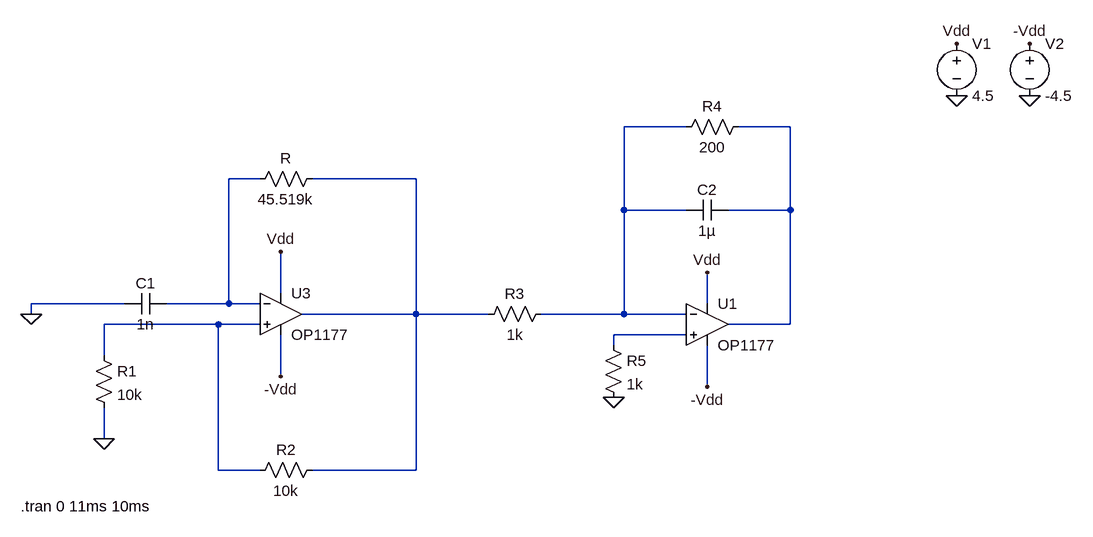
[diagram p0: schematic 2a.asc]
2a.asc, the LTspice schematic file:
Version 4.1
SHEET 1 1464 680
WIRE 864 -144 768 -144
WIRE 1024 -144 944 -144
WIRE 208 -64 160 -64
WIRE 448 -64 288 -64
WIRE 768 -16 768 -144
WIRE 864 -16 768 -16
WIRE 1024 -16 1024 -144
WIRE 1024 -16 928 -16
WIRE 240 112 240 48
WIRE 0 128 -144 128
WIRE 160 128 160 -64
WIRE 160 128 64 128
WIRE 208 128 160 128
WIRE 896 128 896 80
WIRE -144 144 -144 128
WIRE 448 144 448 -64
WIRE 448 144 272 144
WIRE 560 144 448 144
WIRE 768 144 768 -16
WIRE 768 144 640 144
WIRE 864 144 768 144
WIRE 144 160 -32 160
WIRE 208 160 144 160
WIRE 1024 160 1024 -16
WIRE 1024 160 928 160
WIRE 864 176 752 176
WIRE 752 192 752 176
WIRE -32 208 -32 160
WIRE 240 240 240 176
WIRE 896 256 896 192
WIRE -32 336 -32 288
WIRE 144 384 144 160
WIRE 208 384 144 384
WIRE 448 384 448 144
WIRE 448 384 288 384
FLAG -32 336 0
FLAG -144 144 0
FLAG 1280 -192 0
FLAG 1392 -192 0
FLAG 1280 -272 Vdd
FLAG 1392 -272 -Vdd
FLAG 240 48 Vdd
FLAG 240 240 -Vdd
FLAG 896 80 Vdd
FLAG 896 256 -Vdd
FLAG 752 272 0
SYMBOL res 304 -80 R90
WINDOW 0 0 56 VBottom 2
WINDOW 3 32 56 VTop 2
SYMATTR InstName R
SYMATTR Value 45.519k
SYMBOL res 304 368 R90
WINDOW 0 0 56 VBottom 2
WINDOW 3 32 56 VTop 2
SYMATTR InstName R2
SYMATTR Value 10k
SYMBOL cap 64 112 R90
WINDOW 0 0 32 VBottom 2
WINDOW 3 32 32 VTop 2
SYMATTR InstName C1
SYMATTR Value 1n
SYMBOL res -48 192 R0
SYMATTR InstName R1
SYMATTR Value 10k
SYMBOL voltage 1280 -288 R0
SYMATTR InstName V1
SYMATTR Value 4.5
SYMBOL voltage 1392 -288 R0
SYMATTR InstName V2
SYMATTR Value -4.5
SYMBOL OpAmps\\OP1177 240 80 R0
SYMATTR InstName U3
SYMBOL res 656 128 R90
WINDOW 0 0 56 VBottom 2
WINDOW 3 32 56 VTop 2
SYMATTR InstName R3
SYMATTR Value 1k
SYMBOL OpAmps\\OP1177 896 96 R0
SYMATTR InstName U1
SYMBOL cap 928 -32 R90
WINDOW 0 0 32 VBottom 2
WINDOW 3 32 32 VTop 2
SYMATTR InstName C2
SYMATTR Value 1µ
SYMBOL res 960 -160 R90
WINDOW 0 0 56 VBottom 2
WINDOW 3 32 56 VTop 2
SYMATTR InstName R4
SYMATTR Value 200
SYMBOL res 736 176 R0
SYMATTR InstName R5
SYMATTR Value 1k
TEXT -160 440 Left 2 !.tran 0 11ms 10ms

The netlist it stands for:
* 2a.asc
R N004 N003 45.519k
R2 N004 N005 10k
C1 N003 0 1n
R1 N005 0 10k
V1 Vdd 0 4.5
V2 -Vdd 0 -4.5
X§U3 N005 N003 Vdd -Vdd N004 OP1177  ; pins In+ In- V+ V- OUT
R3 N001 N004 1k
X§U1 N006 N001 Vdd -Vdd N002 OP1177  ; pins In+ In- V+ V- OUT
C2 N002 N001 1µ
R4 N002 N001 200
R5 N006 0 1k
.tran 0 11ms 10ms
.lib ADI1.lib
.backanno
.end